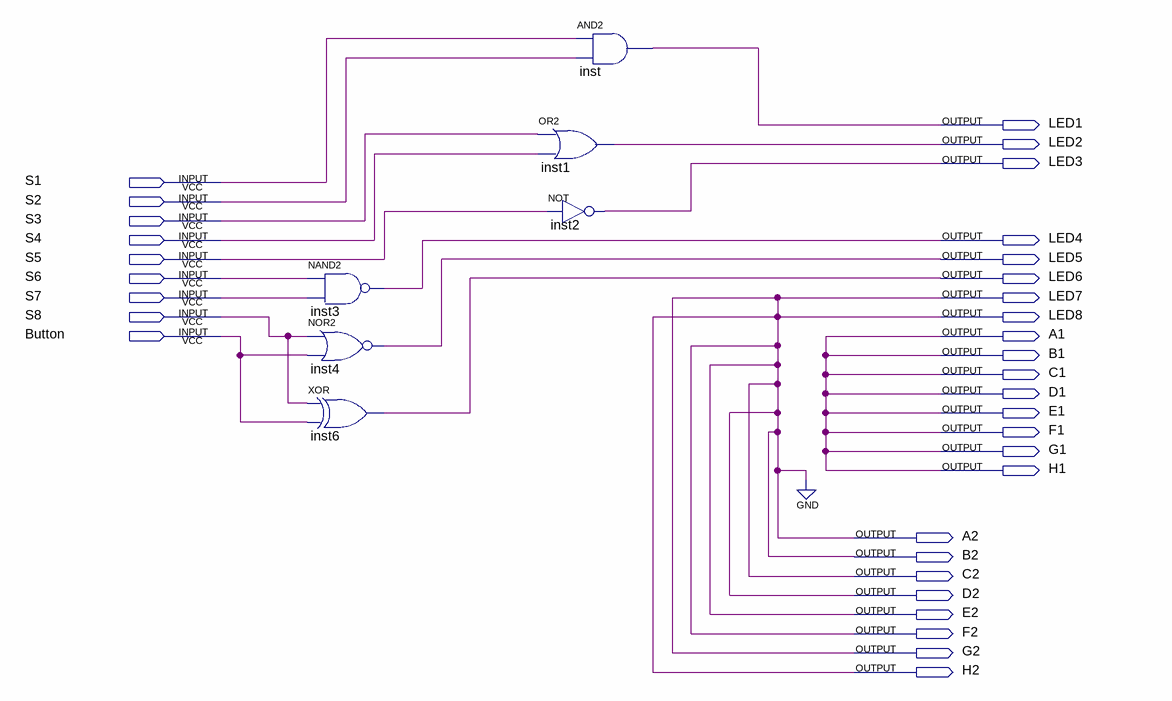
[diagram p0: schematic sheet]
// Quartus schematic base1.bdf as structural Verilog: 6 symbols, 33 pins
module base1 (
  input  S1,
  input  S2,
  input  S3,
  input  S4,
  input  S5,
  input  S6,
  input  S7,
  input  S8,
  input  Button,
  output LED1,
  output LED2,
  output LED3,
  output LED4,
  output LED5,
  output LED6,
  output LED7,
  output LED8,
  output A1,
  output B1,
  output C1,
  output D1,
  output E1,
  output F1,
  output G1,
  output H1,
  output A2,
  output B2,
  output C2,
  output D2,
  output E2,
  output F2,
  output G2,
  output H2
);

  nand inst3 (LED4, S6, S7);
  nor inst4 (LED5, S8, Button);
  xor inst6 (LED6, S8, Button);
  and inst (LED1, S1, S2);
  or inst1 (LED2, S3, S4);
  not inst2 (LED3, S5);

  assign A2 = 1'b0;
  assign B1 = A1;
  assign B2 = 1'b0;
  assign C1 = A1;
  assign C2 = 1'b0;
  assign D1 = A1;
  assign D2 = 1'b0;
  assign E1 = A1;
  assign E2 = 1'b0;
  assign F1 = A1;
  assign F2 = 1'b0;
  assign G1 = A1;
  assign G2 = 1'b0;
  assign H1 = A1;
  assign H2 = 1'b0;
  assign LED7 = 1'b0;
  assign LED8 = 1'b0;
endmodule
